# EAGLE design qPCR_pcb_breakout_MAX6126AASA30+T (EAGLE 9.6.1)
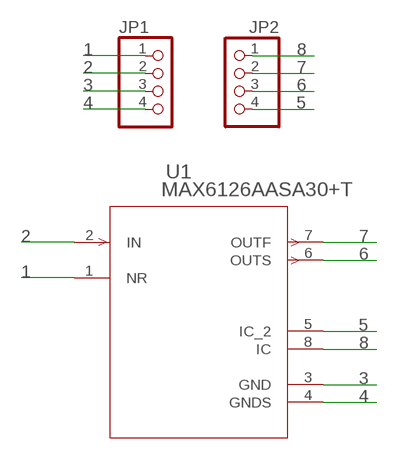
[diagram p0: schematic, sheet 1]

## Parts
JP1  PINHD-1X4  [1X04]
JP2  PINHD-1X4  [1X04]
U1  MAX6126AASA30+T  [21-0041B_8_MXM]

## Nets
1: JP1.1 U1.1(NR)
2: JP1.2 U1.2(IN)
3: JP1.3 U1.3(GND)
4: JP1.4 U1.4(GNDS)
5: JP2.4 U1.5(IC_2)
6: JP2.3 U1.6(OUTS)
7: JP2.2 U1.7(OUTF)
8: JP2.1 U1.8(IC)

## Library data of the parts
JP1 JP2 = pinhead:PINHD-1X4: PIN HEADER
U1 = Ninja_qPCR:MAX6126AASA30+T; BUILT_BY: EMA_UL_Team; MANUFACTURER_PART_NUMBER: max6126aasa30+T; SOURCELIBRARY: Maxim_2014-06-20; VENDOR: Maxim Integrated Products

## Board
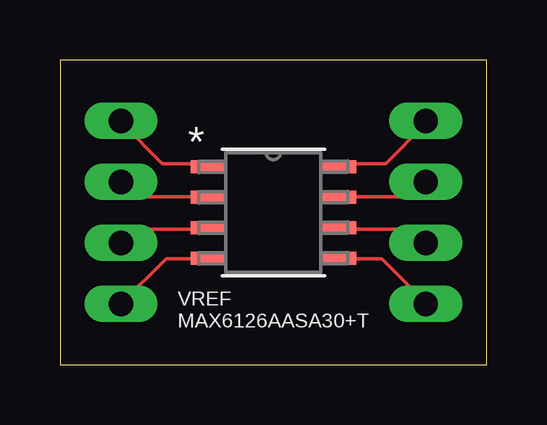
[diagram p1: board, top side]
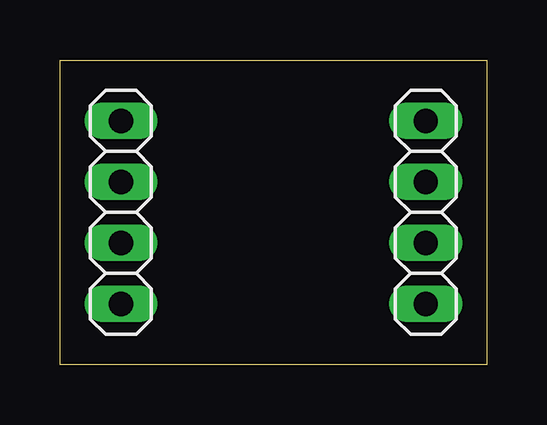
[diagram p2: board, bottom side, seen from below]

Size 17.78 x 12.7 mm. Coordinates in mm from the lower left corner, seen from the top.
Outline: 0,0 17.78,0 17.78,12.7 0,12.7 0,0
Copper layers (1*16): Top 0.035mm / dielectric 1.5mm / Bottom 0.035mm
Design rules "default": minimum track width 6mil, minimum drill 0.35mm, track to track 6mil, track to pad 6mil, pad to pad 6mil, via to via 6mil, smd to smd 6mil, copper to edge 40mil, drill to drill 6mil, minimum pad ring 10mil, minimum via ring 8mil, stop-mask expansion 4mil, vias tented up to drill 0mil, thermal gap 10mil

### Footprints (pad centres in the part's own frame; a part is rotated, then mirrored left to right if it is on the bottom)
1X04 = drill 1.016 long: 1 -3.81,0; 2 -1.27,0; 3 1.27,0; 4 3.81,0
21-0041B_8_MXM = smd 1.455 x 0.543: 1 -2.721,1.905; 2 -2.721,0.635; 3 -2.721,-0.635; 4 -2.721,-1.905; 5 2.721,-1.905; 6 2.721,-0.635; 7 2.721,0.635; 8 2.721,1.905

### Placement (x,y rotation side)
JP1  2.54,6.35 270 bottom
JP2  15.24,6.35 270 bottom
U1  8.89,6.35 0 top

### Tracks (layer width: path | path; a pad name or v marks a point on that pad's centre or on a via)
1
  Top 0.152: U1.1 6.1,8.38 4.27,8.38 2.59,10.06 JP1.1
2
  Top 0.152: U1.2 6.1,7.01 3.2,7.01 2.59,7.62 JP1.2
3
  Top 0.152: U1.3 6.1,5.64 3.05,5.64 2.59,5.18 JP1.3
4
  Top 0.152: JP1.4 4.42,4.42 6.1,4.42 U1.4
5
  Top 0.152: U1.5 11.73,4.42 13.41,4.42 15.24,2.59 JP2.4
6
  Top 0.152: U1.6 11.73,5.64 14.78,5.64 15.24,5.18 JP2.3
7
  Top 0.152: JP2.2 14.63,7.01 11.73,7.01 U1.7
8
  Top 0.152: U1.8 11.73,8.38 13.56,8.38 15.24,10.06 JP2.1

### Text on the board
tPlace: VREF / MAX6126AASA30+T